# EAGLE design ATX Power Supply (EAGLE 5.11)
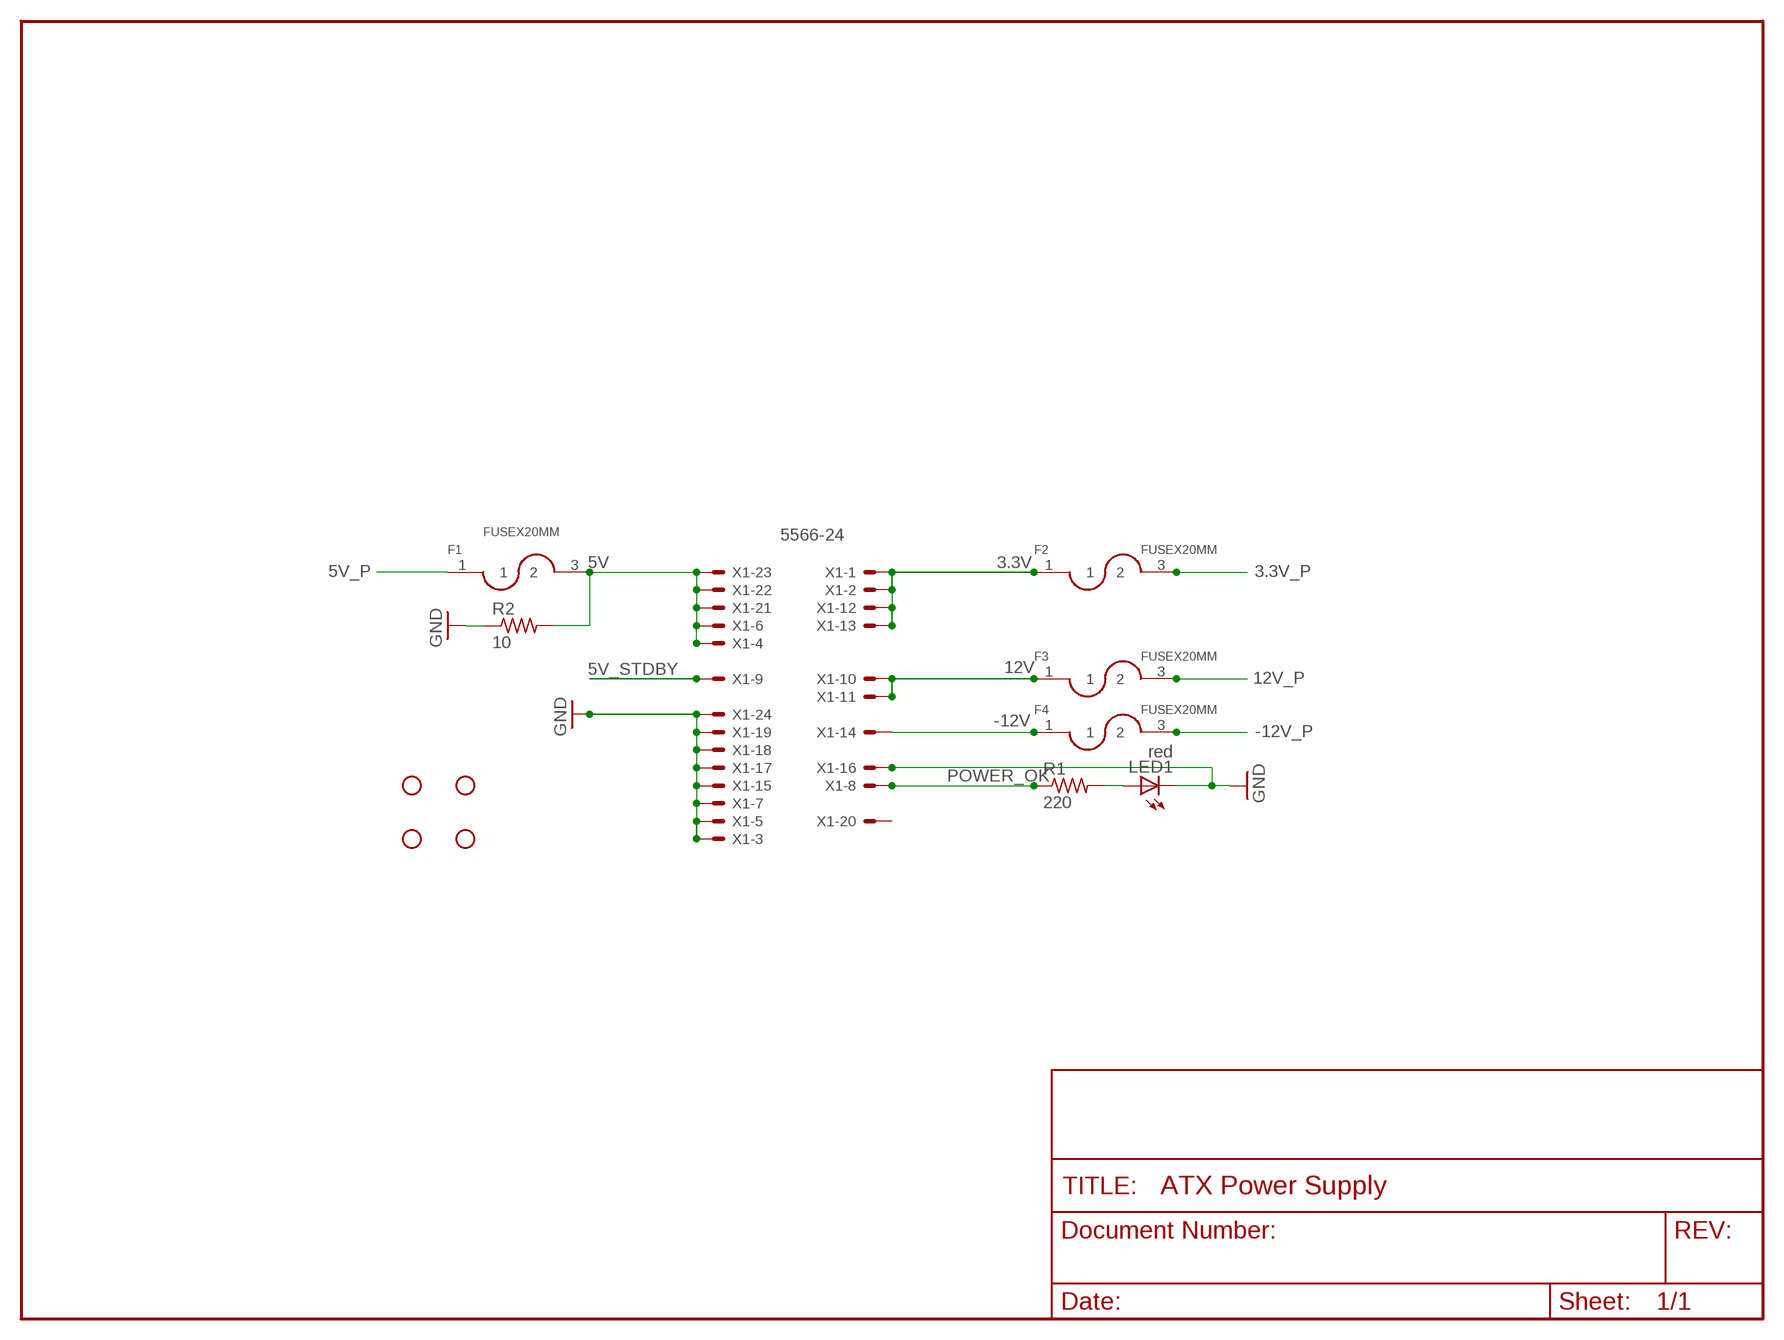
[diagram p0: schematic, sheet 1]

## Parts
F1  FUSEX20MM  [FUSE_5MM]
F2  FUSEX20MM  [FUSE_5MM]
F3  FUSEX20MM  [FUSE_5MM]
F4  FUSEX20MM  [FUSE_5MM]
JP2  STAND-OFF  [STAND-OFF]
JP3  STAND-OFF  [STAND-OFF]
JP4  STAND-OFF  [STAND-OFF]
JP5  STAND-OFF  [STAND-OFF]
LED1  red  LED5MM  [LED5MM]
R1  220  R-US_0204/2V  [0204V]
R2  10  R-US_0204/7  [0204/7]
X1  5566-24  [5566-24]

## Nets
3.3V: F2.1 X1.1 X1.2 X1.12 X1.13
3.3V_P: F2.3
5V: F1.3 R2.2 X1.4 X1.6 X1.21 X1.22 X1.23
5V_P: F1.1
5V_STDBY: X1.9
12V: F3.1 X1.10 X1.11
12V_P: F3.3
-12V: F4.1 X1.14
-12V_P: F4.3
GND: LED1.K(C) R2.1 X1.3 X1.5 X1.7 X1.15 X1.16 X1.17 X1.18 X1.19 X1.24
N$1: LED1.A R1.2
POWER_OK: R1.1 X1.8
Unconnected: X1.20

## Library data of the parts
F1-F4 = SparkFun:FUSE
JP2-JP5 = SparkFun:STAND-OFF: Stand Off This is the mechanical footprint for a #4 phillips button head screw. Use the keepout ring to avoid running the screw head into surrounding components. SKU : PRT-00447
LED1 = led:LED: LED OSRAM: - CHIPLED LG R971, LG N971, LY N971, LG Q971, LY Q971, LO R971, LY R971 LH N974, LH R974 LS Q976, LO Q976, LY Q976 LO Q996 - Hyper CHIPLED LW Q18S LB Q993, LB Q99A, LB R99A - SideLED LS A670, LO A670, LY A670, LG A670, LP A670 LB A673, LV A673, LT A673, LW A673 LH A674 LY A675 LS A676, LA A676, LO A676, LY A676, LW A676 LS A679, LY A679, LG A679 - Hyper Micro SIDELED® LS Y876, LA Y876, LO Y876, LY Y876 LT Y87S - SmartLED LW L88C, LW L88S LB L89C, LB L89S, LG L890 LS L89K, LO L89K, LY L89K LS L896, LA L896, LO L896, LY L896 - TOPLED LS T670, LO T670, LY T670, LG T670, LP T670 LSG T670, LSP T670, LSY T670, LOP T670, LYG T670 LG T671, LOG T671, LSG T671 LB T673, LV T673, LT T673, LW T673 LH T674 LS T676, LA T676, LO T676, LY T676, LB T676, LH T676, LSB T676, LW T676 LB T67C, LV T67C, LT T67C, LS T67K, LO T67K, LY T67K, LW E67C LS E67B, LA E67B, LO E67B, LY E67B, LB E67C, LV E67C, LT E67C LW T67C LS T679, LY T679, LG T679 LS T770, LO T770, LY T770, LG T770, LP T770 LB T773, LV T773, LT T773, LW T773 LH T774 LS E675, LA E675, LY E675, LS T675 LS T776, LA T776, LO T776, LY T776, LB T776 LHGB T686 LT T68C, LB T68C - Hyper Mini TOPLED® LB M676 - Mini TOPLED Santana® LG M470 LS M47K, LO M47K, LY M47K Source: http://www.osram.convergy.de LUXEON: - LUMILED® LXK2-PW12-R00, LXK2-PW12-S00, LXK2-PW14-U00, LXK2-PW14-V00 LXK2-PM12-R00, LXK2-PM12-S00, LXK2-PM14-U00 LXK2-PE12-Q00, LXK2-PE12-R00, LXK2-PE12-S00, LXK2-PE14-T00, LXK2-PE14-U00 LXK2-PB12-K00, LXK2-PB12-L00, LXK2-PB12-M00, LXK2-PB14-N00, LXK2-PB14-P00, LXK2-PB14-Q00 LXK2-PR12-L00, LXK2-PR12-M00, LXK2-PR14-Q00, LXK2-PR14-R00 LXK2-PD12-Q00, LXK2-PD12-R00, LXK2-PD12-S00 LXK2-PH12-R00, LXK2-PH12-S00 LXK2-PL12-P00, LXK2-PL12-Q00, LXK2-PL12-R00 Source: www.luxeon.com KINGBRIGHT: KA-3528ASYC Source: www.kingbright.com
R1 R2 = resistor:R-US_: RESISTOR, American symbol
X1 = con-molex:5566-24: Mini FIT connector 24 pol Source: http://www.molex.com; OC_FARNELL: unknown; OC_NEWARK: unknown

## Board
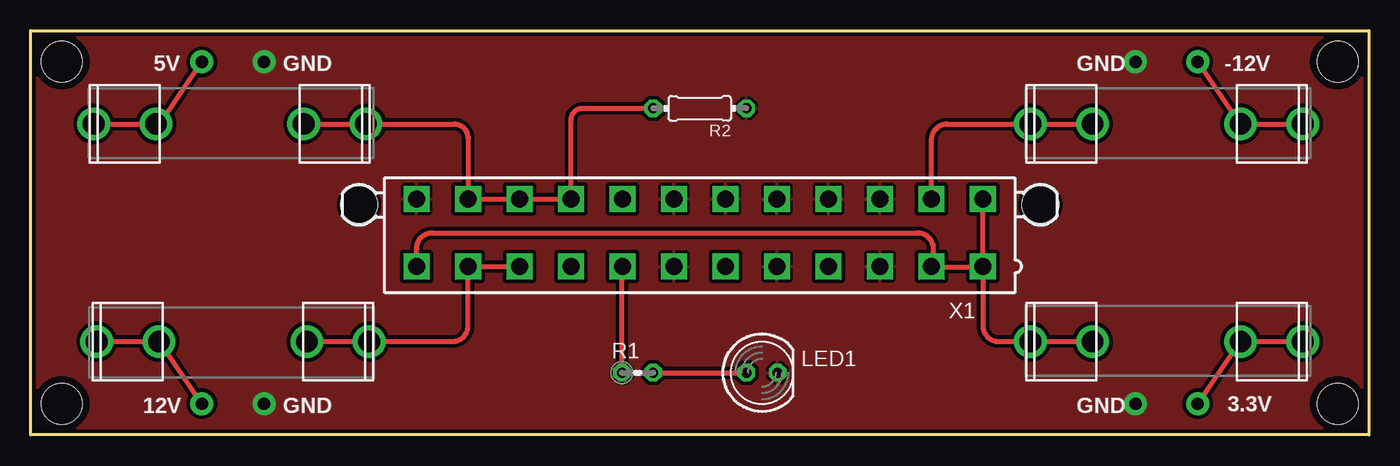
[diagram p1: board, top side]
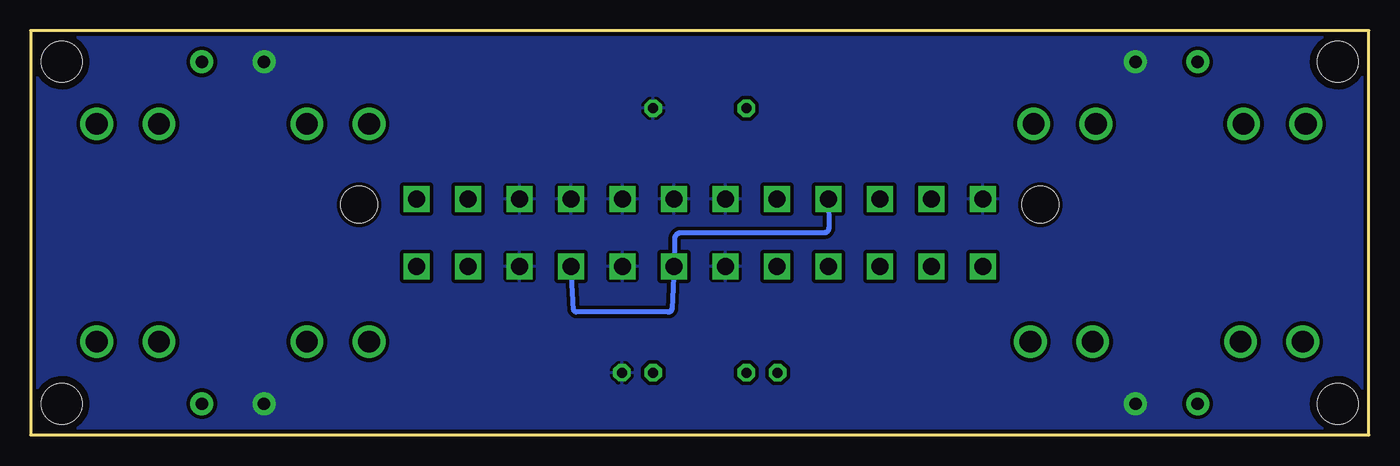
[diagram p2: board, bottom side, seen from below]

Size 109.22 x 33.02 mm. Coordinates in mm from the lower left corner, seen from the top.
Outline: 0,0 0,33.02 109.22,33.02 109.22,0 0,0
Copper layers (1*16): Top 0.035mm / dielectric 1.5mm / Bottom 0.035mm
Design rules "SparkFun": minimum track width 8mil, minimum drill 20mil, track to track 8mil, track to pad 8mil, pad to pad 8mil, via to via 8mil, smd to smd 8mil, copper to edge 8mil, drill to drill 8mil, minimum pad ring 12mil, minimum via ring 10mil, stop-mask expansion 4mil, vias tented up to drill 20mil, thermal gap 10mil

### Footprints (pad centres in the part's own frame; a part is rotated, then mirrored left to right if it is on the bottom)
FUSE_5MM = drill 1.778 round: 1 0,-11.113; 2 0,-6.032; 3 0,6.032; 4 0,11.113
STAND-OFF = hole 3.302: 0,0
LED5MM = drill 0.813 octagon: A -1.27,0; K 1.27,0
0204V = drill 0.813 octagon: 1 -1.27,0; 2 1.27,0
0204/7 = drill 0.813 octagon: 1 -3.81,0; 2 3.81,0
5566-24 = drill 1.4 square: 1 23.1,-2.75; 2 18.9,-2.75; 3 14.7,-2.75; 4 10.5,-2.75; 5 6.3,-2.75; 6 2.1,-2.75; 7 -2.1,-2.75; 8 -6.3,-2.75; 9 -10.5,-2.75; 10 -14.7,-2.75; 11 -18.9,-2.75; 12 -23.1,-2.75; 13 23.1,2.75; 14 18.9,2.75; 15 14.7,2.75; 16 10.5,2.75; 17 6.3,2.75; 18 2.1,2.75; 19 -2.1,2.75; 20 -6.3,2.75; 21 -10.5,2.75; 22 -14.7,2.75; 23 -18.9,2.75; 24 -23.1,2.75 | hole 3: 27.8,2.29; -27.8,2.29

### Placement (x,y rotation side)
F1  16.26,25.4 270 top
F2  92.71,7.62 270 top
F3  16.51,7.62 90 top
F4  92.71,25.4 270 top
JP2  106.68,2.54 0 top
JP3  106.68,30.48 0 top
JP4  2.54,2.54 0 top
JP5  2.54,30.48 0 top
LED1  59.69,5.08 0 top
R1  49.53,5.08 0 top
R2  54.61,26.67 180 top
X1  54.61,16.51 0 top

### Tracks (layer width: path | path; a pad name or v marks a point on that pad's centre or on a via)
3.3V
  Top 0.203: 73.66,13.72 X1.2 | 77.72,19.05 X1.13 | 77.72,13.72 X1.1
  Top 0.406: 77.72,13.72 77.72,8.91 arc90 79.02,7.62 81.28,7.62 | 81.28,7.62 F2.1 | 77.72,13.72 77.72,19.05 | 77.72,13.72 73.66,13.72 73.66,15.24 arc90 72.39,16.51 32.8,16.51 arc90 31.5,15.21 X1.12 | 81.28,7.62 86.36,7.62
3.3V_P  (via drill 1.02 pad 1.88)
  Top 0.406: v95.25,2.54 F2.3
5V
  Top 0.406: F1.3 27.3,25.4 34.55,25.4 arc-90 35.69,24.25 X1.23 X1.22 X1.21 44.11,25.74 arc-90 45.04,26.67 R2.2
  Bottom 0.406: X1.4 64.91,10.2 64.73,10.03 57.17,10.03 arc-87 56.88,10.3 X1.6 56.65,16.01 arc89 56.15,16.51 44.46,16.51 arc-91 44.08,16.9 X1.21
5V_P  (via drill 1.02 pad 1.88)
  Top 0.406: v13.97,30.48 10.54,25.4 F1.1
12V
  Top 0.406: 27.94,7.62 F3.1 | 27.94,7.62 34.42,7.62 arc90 35.69,8.9 X1.11 X1.10 | 22.86,7.62 27.94,7.62
12V_P  (via drill 1.02 pad 1.88)
  Top 0.406: v13.97,2.54 F3.3
-12V
  Top 0.203: X1.14 73.53,19.05
  Top 0.406: 73.53,19.05 73.53,24.12 arc-90 74.81,25.4 81.28,25.4 | 81.28,25.4 F4.1 | 81.28,25.4 86.36,25.4
-12V_P  (via drill 1.02 pad 1.88)
  Top 0.406: F4.3 v95.25,30.48
GND  (via drill 1.02 pad 1.88)
  other vias: 19.05,2.54 19.05,30.48 90.17,30.48 90.17,2.54
  pour Bottom (isolate 0.305): 0,0 0,33.02 109.22,33.02 109.22,0
  pour Top (isolate 0.305): 0,0 0,33.02 109.22,33.02 109.22,0
N$1
  Top 0.406: R1.2 LED1.A
N$2
  Top 0.406: 5.08,7.62 10.16,7.62
N$3
  Top 0.406: 99.06,7.62 104.14,7.62
N$4
  Top 0.406: 99.06,25.4 104.14,25.4
POWER_OK
  Top 0.406: X1.8 48.26,13.76 R1.1

### Text on the board
tPlace: 5V | GND | GND | -12V | 12V | GND | GND | 3.3V